# EAGLE board PDC Senior Project (EAGLE 7.7.0), part 1 of 2
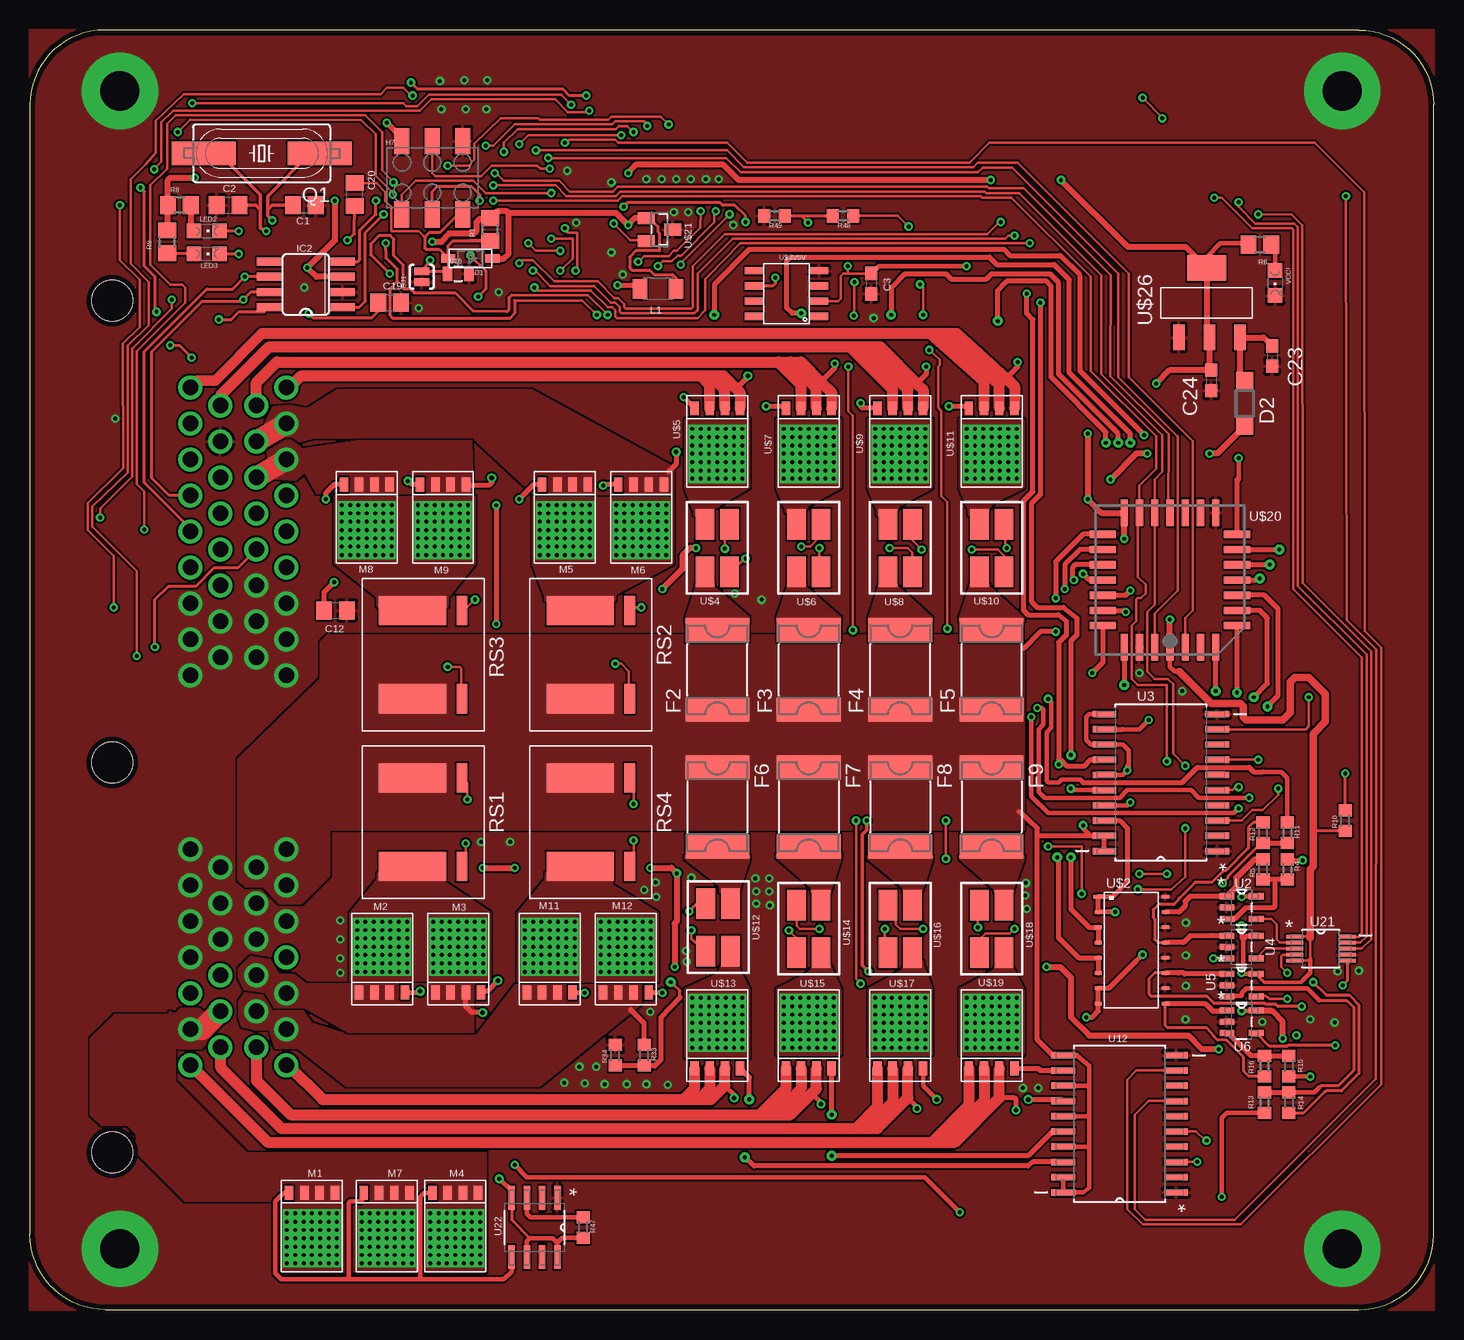
[diagram p7: board, top side]
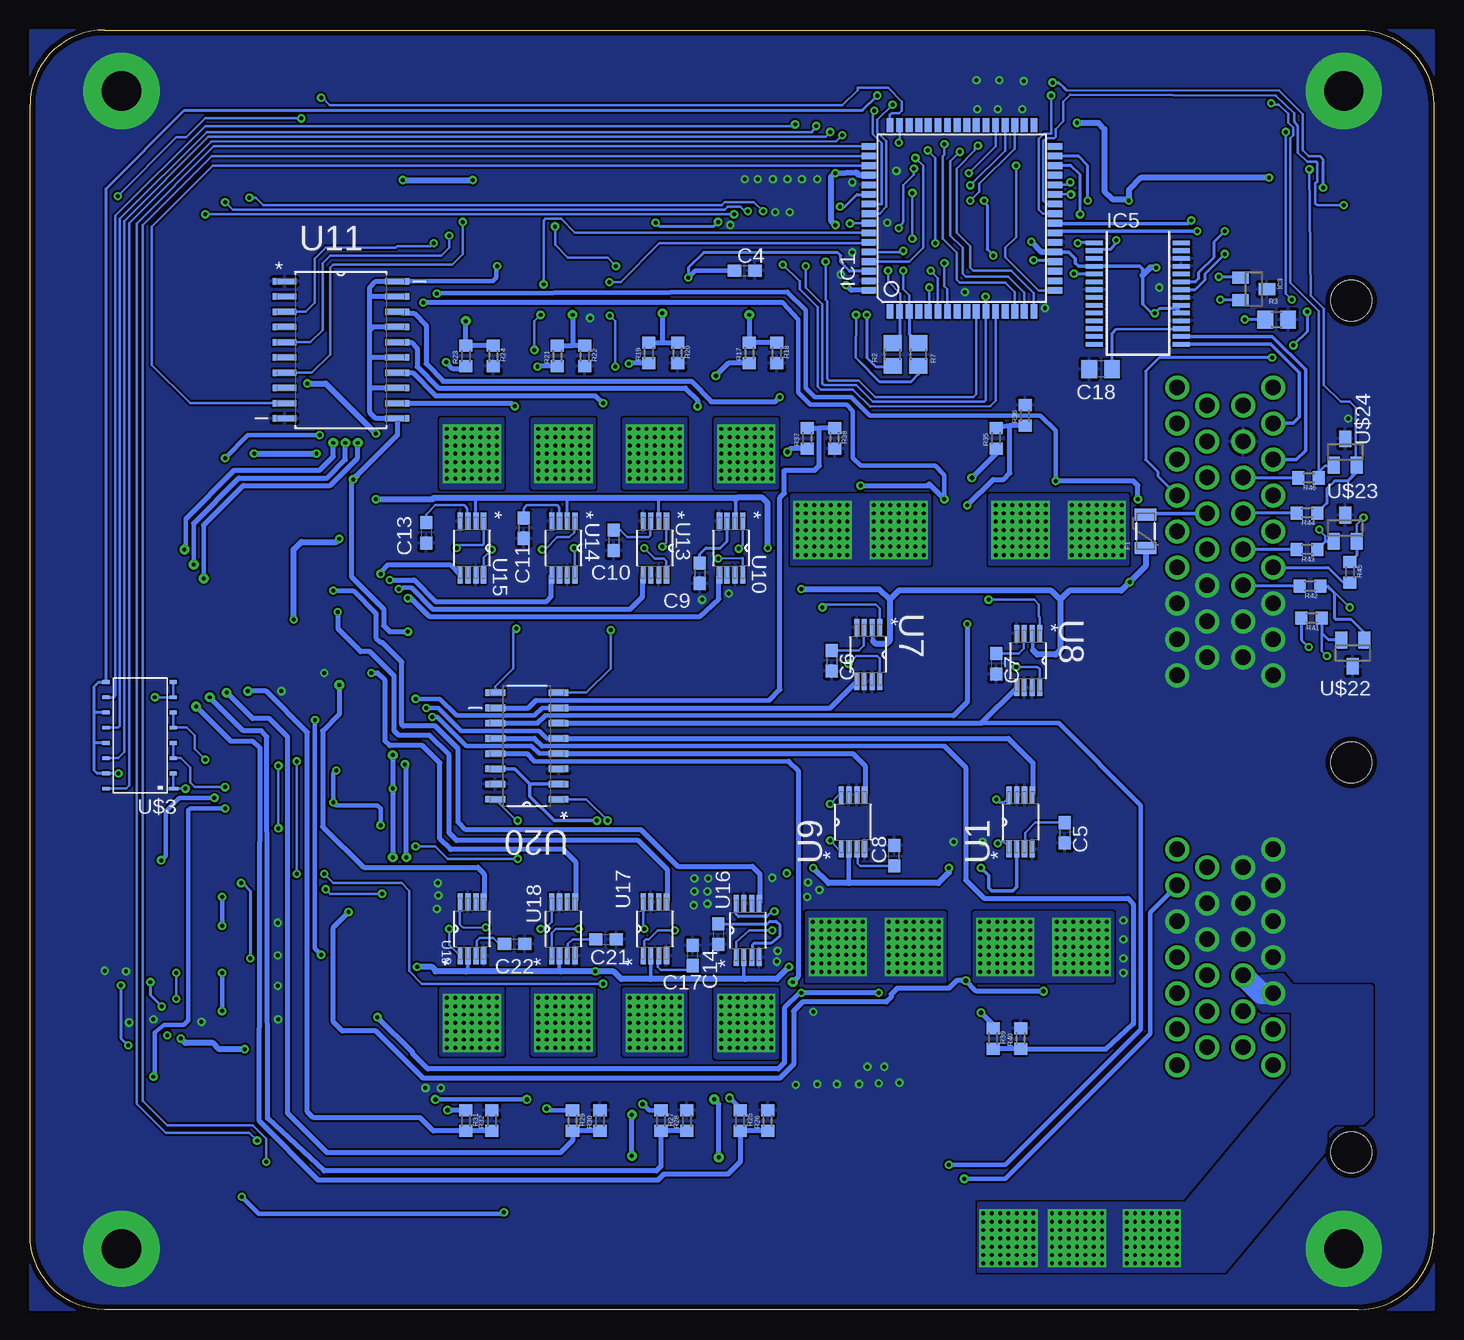
[diagram p8: board, bottom side, seen from below]

Size 116.97 x 106.68 mm. Coordinates in mm from the lower left corner, seen from the top.
Outline: 6.29,0 110.74,0 arc90 116.97,6.22 116.97,100.46 arc90 110.74,106.68 6.22,106.68 arc90 0,100.46 0,6.29 arc90 6.29,0
Copper layers (1*16): Top 0.0356mm / dielectric 1.5011mm / Bottom 0.0356mm
Design rules "OshPark DRC *": minimum track width 6mil, minimum drill 13mil, track to track 6.5mil, track to pad 6.5mil, pad to pad 6.5mil, via to via 6.5mil, smd to smd 6.5mil, copper to edge 17mil, drill to drill 7mil, minimum pad ring 7mil, minimum via ring 7mil, stop-mask expansion 3mil, vias tented up to drill 0mil, thermal gap 10mil

## Footprints (pad centres in the part's own frame; a part is rotated, then mirrored left to right if it is on the bottom)
C0805 = smd 1.3 x 1.5: 1 -0.95,0; 2 0.95,0
C0603 = smd 1.1 x 1: 1 -0.85,0; 2 0.85,0
0805 = smd 0.8 x 1.2: 1 -0.9,0; 2 0.9,0
SOD-123 = smd 1.2 x 0.7: A 1.85,0; C -1.85,0
SOD123 = smd 1.4 x 1.4: A 1.9,0; C -1.9,0
PTC-1206 = smd 1 x 1.8: 1 -1.4,0; 2 1.4,0
2920L = smd 2 x 5.3: 1 -3.3,0; 2 3.3,0
#4-40-PAD-ROUND = drill 3.264 pad 6.35: P$1 0,0
2X3_SMD_FCI_54202-G30 = smd 1.27 x 2.18: 1 -2.54,-3.05; 2 -2.54,3.05; 3 0,-3.05; 4 0,3.05; 5 2.54,-3.05; 6 2.54,3.05
TQFP64 = smd 1.194 x 0.559: 1 -7.76,6; 2 -7.76,5.2; 3 -7.76,4.4; 4 -7.76,3.6; 5 -7.76,2.8; 6 -7.76,2; 7 -7.76,1.2; 8 -7.76,0.4; 9 -7.76,-0.4; 10 -7.76,-1.2; 11 -7.76,-2; 12 -7.76,-2.8; 13 -7.76,-3.6; 14 -7.76,-4.4; 15 -7.76,-5.2; 16 -7.76,-6; 33 7.76,-6; 34 7.76,-5.2; 35 7.76,-4.4; 36 7.76,-3.6; 37 7.76,-2.8; 38 7.76,-2; 39 7.76,-1.2; 40 7.76,-0.4; 41 7.76,0.4; 42 7.76,1.2; 43 7.76,2; 44 7.76,2.8; 45 7.76,3.6; 46 7.76,4.4; 47 7.76,5.2; 48 7.76,6 | smd 0.559 x 1.194: 17 -6,-7.76; 18 -5.2,-7.76; 19 -4.4,-7.76; 20 -3.6,-7.76; 21 -2.8,-7.76; 22 -2,-7.76; 23 -1.2,-7.76; 24 -0.4,-7.76; 25 0.4,-7.76; 26 1.2,-7.76; 27 2,-7.76; 28 2.8,-7.76; 29 3.6,-7.76; 30 4.4,-7.76; 31 5.2,-7.76; 32 6,-7.76; 49 6,7.76; 50 5.2,7.76; 51 4.4,7.76; 52 3.6,7.76; 53 2.8,7.76; 54 2,7.76; 55 1.2,7.76; 56 0.4,7.76; 57 -0.4,7.76; 58 -1.2,7.76; 59 -2,7.76; 60 -2.8,7.76; 61 -3.6,7.76; 62 -4.4,7.76; 63 -5.2,7.76; 64 -6,7.76
SO08 = smd 0.66 x 2.032: 1 -1.905,-3.073; 2 -0.635,-3.073; 3 0.635,-3.073; 4 1.905,-3.073; 5 1.905,3.073; 6 0.635,3.073; 7 -0.635,3.073; 8 -1.905,3.073
SOT-23 = smd 1 x 1.4: 1 -0.95,-1.1; 2 0.95,-1.1; 3 0,1.1
SSOP28 = smd 0.381 x 1.499: 1 -4.225,-3.625; 2 -3.575,-3.625; 3 -2.925,-3.625; 4 -2.275,-3.625; 5 -1.625,-3.625; 6 -0.975,-3.625; 7 -0.325,-3.625; 8 0.325,-3.625; 9 0.975,-3.625; 10 1.625,-3.625; 11 2.275,-3.625; 12 2.925,-3.625; 13 3.575,-3.625; 14 4.225,-3.625; 15 4.225,3.625; 16 3.575,3.625; 17 2.925,3.625; 18 2.275,3.625; 19 1.625,3.625; 20 0.975,3.625; 21 0.325,3.625; 22 -0.325,3.625; 23 -0.975,3.625; 24 -1.625,3.625; 25 -2.275,3.625; 26 -2.925,3.625; 27 -3.575,3.625; 28 -4.225,3.625
L3216C = smd 1.2 x 1.6: 1 -1.5,0; 2 1.5,0
CHIPLED_0805 = smd 1.2 x 1.2: A 0,-1.05; C 0,1.05
SOT669(LFPAK_POWER-SO8) = smd 0.7 x 1.15: 1 -1.905,-2.75; 2 -0.635,-2.75; 3 0.635,-2.75; 4 1.905,-2.75 | drill 0.33 pad 0.508 square: P$1 -2.083,3.124; P$2 -1.388,3.124; P$3 -2.083,-1.041; P$4 -0.694,3.124; P$5 -1.388,-1.041; P$6 0,3.124; P$7 -0.694,-1.041; P$8 0.694,3.124; P$9 1.388,3.124; P$10 0,-1.041; P$11 0.694,-1.041; P$12 1.388,-1.041; P$13 2.083,-1.041; P$18 2.083,3.124; P$19 -2.083,2.43; P$20 -1.388,2.43; P$21 -0.694,2.43; P$22 0,2.43; P$23 0.694,2.43; P$24 1.388,2.43; P$25 2.083,2.43; P$28 -2.083,1.736; P$29 -1.388,1.736; P$30 -0.694,1.736; P$31 0,1.736; P$32 0.694,1.736; P$33 1.388,1.736; P$34 2.083,1.736; P$37 -2.083,1.041; P$38 -1.388,1.041; P$39 -0.694,1.041; P$40 0,1.041; P$41 0.694,1.041; P$42 1.388,1.041; P$43 2.083,1.041; P$46 -2.083,0.347; P$47 -1.388,0.347; P$48 -0.694,0.347; P$49 0,0.347; P$50 0.694,0.347; P$51 1.388,0.347; P$52 2.083,0.347; P$55 -2.083,-0.347; P$56 -1.388,-0.347; P$57 -0.694,-0.347; P$58 0,-0.347; P$59 0.694,-0.347; P$60 1.388,-0.347; P$61 2.083,-0.347
HC49UP = smd 5.334 x 1.93: 1 -4.826,0; 2 4.826,0
R0805 = smd 1.3 x 1.5: 1 -0.95,0; 2 0.95,0
R0603 = smd 1 x 1.1: 1 -0.85,0; 2 0.85,0
WSL2726_RES = smd 2.438 x 5.588: PAS1 -3.683,0; PAS2 3.683,0 | smd 2.438 x 0.889: SENSE1 -3.683,4.128; SENSE2 3.683,4.128
SJ_2S-NO = smd 0.635 x 1.27: 1 -0.45,0; 2 0.45,0
SOP65P490X110-8N = smd 1.397 x 0.432: 1 -2.261,0.965; 2 -2.261,0.33; 3 -2.261,-0.33; 4 -2.261,-0.965; 5 2.261,-0.965; 6 2.261,-0.33; 7 2.261,0.33; 8 2.261,0.965
SOT95P280X100-5N = smd 1.219 x 0.508: 1 -1.219,0.94; 2 -1.219,0; 3 -1.219,-0.94; 4 1.219,-0.94; 5 1.219,0.94
SOIC127P1032X264-20N = smd 1.981 x 0.533: 1 -4.699,5.715; 2 -4.699,4.445; 3 -4.699,3.175; 4 -4.699,1.905; 5 -4.699,0.635; 6 -4.699,-0.635; 7 -4.699,-1.905; 8 -4.699,-3.175; 9 -4.699,-4.445; 10 -4.699,-5.715; 11 4.699,-5.715; 12 4.699,-4.445; 13 4.699,-3.175; 14 4.699,-1.905; 15 4.699,-0.635; 16 4.699,0.635; 17 4.699,1.905; 18 4.699,3.175; 19 4.699,4.445; 20 4.699,5.715
SOIC127P600X175-16N = smd 1.651 x 0.559: 1 -2.642,4.445; 2 -2.642,3.175; 3 -2.642,1.905; 4 -2.642,0.635; 5 -2.642,-0.635; 6 -2.642,-1.905; 7 -2.642,-3.175; 8 -2.642,-4.445; 9 2.642,-4.445; 10 2.642,-3.175; 11 2.642,-1.905; 12 2.642,-0.635; 13 2.642,0.635; 14 2.642,1.905; 15 2.642,3.175; 16 2.642,4.445
SOP50P490X110-10N = smd 1.422 x 0.305: 1 -2.184,0.991; 2 -2.184,0.508; 3 -2.184,0; 4 -2.184,-0.508; 5 -2.184,-0.991; 6 2.184,-0.991; 7 2.184,-0.508; 8 2.184,0; 9 2.184,0.508; 10 2.184,0.991
SOIC127P600X175-8N = smd 1.981 x 0.533: 1 -2.464,1.905; 2 -2.464,0.635; 3 -2.464,-0.635; 4 -2.464,-1.905; 5 2.464,-1.905; 6 2.464,-0.635; 7 2.464,0.635; 8 2.464,1.905
SOIC16NB = smd 0.305 x 0.8: 1 -4.445,-2.8 | smd 0.305 x 0.61: 2 -3.175,-2.8; 3 -1.905,-2.8; 4 -0.635,-2.8; 5 0.635,-2.8; 6 1.905,-2.8; 7 3.175,-2.8; 8 4.445,-2.8; 9 4.445,2.8; 10 3.175,2.8; 11 1.905,2.8; 12 0.635,2.8; 13 -0.635,2.8; 14 -1.905,2.8; 15 -3.175,2.8; 16 -4.445,2.8
LVK2010 = smd 2.55 x 1.55: I1 -1.975,-1.025; I2 1.975,-1.025; V1 -1.975,1.025; V2 1.975,1.025
8-SOIC = smd 0.6 x 1.55: P1 -1.905,-2.7; P2 -0.635,-2.7; P3 0.635,-2.7; P4 1.905,-2.7; P5 1.905,2.7; P6 0.635,2.7; P7 -0.635,2.7; P8 -1.905,2.7
PLCC28S = smd 0.6 x 2.2: 1 0,5.6; 2 -1.27,5.6; 3 -2.54,5.6; 4 -3.81,5.6; 12 -3.81,-5.6; 13 -2.54,-5.6; 14 -1.27,-5.6; 15 0,-5.6; 16 1.27,-5.6; 17 2.54,-5.6; 18 3.81,-5.6; 26 3.81,5.6; 27 2.54,5.6; 28 1.27,5.6 | smd 2.2 x 0.6: 5 -5.6,3.81; 6 -5.6,2.54; 7 -5.6,1.27; 8 -5.6,0; 9 -5.6,-1.27; 10 -5.6,-2.54; 11 -5.6,-3.81; 19 5.6,-3.81; 20 5.6,-2.54; 21 5.6,-1.27; 22 5.6,0; 23 5.6,1.27; 24 5.6,2.54; 25 5.6,3.81
SOT23 = smd 1 x 1.4: 1 -0.95,-1.1; 2 0.95,-1.1; 3 0,1.1
SOT23-3 = smd 1 x 1.4: 1 -0.95,-1.1; 2 0.95,-1.1; 3 0,1.1
SUPERSEAL1.0_60POS = drill 1.3 pad 2: A1 -21,6; A2 -18,6; A3 -15,6; A4 -12,6; A5 -9,6; A6 -6,6; A7 -3,6; A8 0,6; A9 3,6; A10 -19.5,3.5; A11 -16.5,3.5; A12 -13.5,3.5; A13 -10.5,3.5; A14 -7.5,3.5; A15 -4.5,3.5; A16 -1.5,3.5; A17 1.5,3.5; A18 -19.5,0.5; A19 -16.5,0.5; A20 -13.5,0.5; A21 -10.5,0.5; A22 -7.5,0.5; A23 -4.5,0.5; A24 -1.5,0.5; A25 1.5,0.5; A26 -21,-2; A27 -18,-2; A28 -15,-2; A29 -12,-2; A30 -9,-2; A31 -6,-2; A32 -3,-2; A33 0,-2; A34 3,-2; B1 17.5,6; B2 20.5,6; B3 23.5,6; B4 26.5,6; B5 29.5,6; B6 32.5,6; B7 35.5,6; B8 19,3.5; B9 22,3.5; B10 25,3.5; B11 28,3.5; B12 31,3.5; B13 34,3.5; B14 19,0.5; B15 22,0.5; B16 25,0.5; B17 28,0.5; B18 31,0.5; B19 34,0.5; B20 17.5,-2; B21 20.5,-2; B22 23.5,-2; B23 26.5,-2; B24 29.5,-2; B25 32.5,-2; B26 35.5,-2 | hole 3.4: -28.25,-8.5; 10.25,-8.5; 42.75,-8.5
SOT-223-4 = smd 0.95 x 2.15: 1 -2.3,-2.9; 2 0.24,-2.9; 3 2.78,-2.9 | smd 3.25 x 2.15: 4 0,2.9

## Placement (x,y rotation side)
C1  18pF  [C0805]  22.86,92.08 180 top
C2  18pF  [C0805]  16.51,92.08 0 top
C3  2.2uF  [C0603]  70.1,85.53 270 top
C4  2.2uF  [C0603]  57.4,86.61 0 bottom
C5  220p  [C0603]  30.73,39.75 270 bottom
C6  220p  [C0603]  50.16,54.1 270 bottom
C7  220p  [C0603]  36.45,53.85 270 bottom
C8  220p  [C0603]  44.96,37.85 90 bottom
C9  220p  [C0603]  61.15,61.4 270 bottom
C10  220p  [C0603]  68.33,64.14 270 bottom
C11  220p  [C0603]  75.82,65.15 270 bottom
C12  100n  [C0805]  25.46,58.29 0 top
C13  220p  [C0603]  83.95,64.77 270 bottom
C14  220p  [C0603]  59.63,31.31 270 bottom
C16  4.7nF  [0805]  35.69,86.36 0 top
C17  220p  [C0603]  61.72,29.53 90 bottom
C18  100n  [C0805]  27.75,78.42 180 bottom
C19  100n  [C0805]  29.97,83.95 0 top
C20  100n  [C0805]  27.05,92.96 90 top
C21  220p  [C0603]  68.96,30.86 0 bottom
C22  220p  [C0603]  76.58,30.48 0 bottom
C23  10uF  [C0603]  103.5,79.5 270 top
C24  10uF  [C0603]  98.42,77.47 270 top
D1  1N4148  [SOD-123]  36.7,87.63 180 top
D2  1N5819  [SOD123]  101.22,75.56 270 top
F1  16V,0.25A  [PTC-1206]  24,64.9 90 bottom
F2  PTC_FUSE2002920L  [2920L]  57.28,53.34 90 top
F3  PTC_FUSE2002920L  [2920L]  64.9,53.34 90 top
F4  PTC_FUSE2002920L  [2920L]  72.52,53.34 90 top
F5  PTC_FUSE2002920L  [2920L]  80.14,53.34 90 top
F6  PTC_FUSE2002920L  [2920L]  57.28,41.91 270 top
F7  PTC_FUSE2002920L  [2920L]  64.9,41.91 270 top
F8  PTC_FUSE2002920L  [2920L]  72.52,41.91 270 top
F9  PTC_FUSE2002920L  [2920L]  80.14,41.91 270 top
H1  MOUNT-PAD-ROUND#4-40-PAD  [#4-40-PAD-ROUND]  109.35,101.6 0 top
H2  MOUNT-PAD-ROUND#4-40-PAD  [#4-40-PAD-ROUND]  109.35,5.08 0 top
H3  MOUNT-PAD-ROUND#4-40-PAD  [#4-40-PAD-ROUND]  7.49,5.08 0 top
H4  MOUNT-PAD-ROUND#4-40-PAD  [#4-40-PAD-ROUND]  7.49,101.6 0 top
H7  ICSP  [2X3_SMD_FCI_54202-G30]  33.53,94.36 0 top
IC1  AT90CAN128  [TQFP64]  39.3,90.98 90 bottom
IC2  MCP2551SO8  [SO08]  22.99,85.47 90 top
IC3  NUP2105L  [SOT-23]  14.99,85.09 270 bottom
IC5  FT232RL  [SSOP28]  24.64,84.71 270 bottom
L1  CS321613-100K  [L3216C]  52.32,85.09 180 top
LED2  RX  [CHIPLED_0805]  14.73,89.92 270 top
LED3  TX  [CHIPLED_0805]  14.73,88.01 270 top
M1  PSMN2R2-25YLC  [SOT669(LFPAK_POWER-SO8)]  23.5,6.99 180 top
M2  PSMN2R2-25YLC  [SOT669(LFPAK_POWER-SO8)]  29.34,29.21 0 top
M3  PSMN2R2-25YLC  [SOT669(LFPAK_POWER-SO8)]  35.69,29.21 0 top
M4  PSMN2R2-25YLC  [SOT669(LFPAK_POWER-SO8)]  35.43,6.99 180 top
M5  PSMN2R2-25YLC  [SOT669(LFPAK_POWER-SO8)]  44.58,66.04 180 top
M6  PSMN2R2-25YLC  [SOT669(LFPAK_POWER-SO8)]  50.93,66.04 180 top
M7  PSMN2R2-25YLC  [SOT669(LFPAK_POWER-SO8)]  29.72,6.99 180 top
M8  PSMN2R2-25YLC  [SOT669(LFPAK_POWER-SO8)]  28.07,66.04 180 top
M9  PSMN2R2-25YLC  [SOT669(LFPAK_POWER-SO8)]  34.42,66.04 180 top
M11  PSMN2R2-25YLC  [SOT669(LFPAK_POWER-SO8)]  43.31,29.21 0 top
M12  PSMN2R2-25YLC  [SOT669(LFPAK_POWER-SO8)]  49.66,29.21 0 top
Q1  56P2859  [HC49UP]  19.3,96.39 180 top
R1  100K  [R0805]  38.35,90.04 90 top
R2  1k  [R0805]  45.09,79.63 90 bottom
R3  100K  [R0805]  13.08,82.55 0 bottom
R4  3k  [R0603]  104.77,36.7 270 top
R5  10k  [R0603]  102.74,36.7 90 top
R6  1K  [R0805]  102.49,88.77 180 top
R7  1k  [R0805]  42.93,79.63 90 bottom
R8  1k  [R0805]  12.45,92.08 180 top
R9  1k  [R0805]  11.43,89.03 90 top
R10  10k  [R0603]  109.6,40.77 90 top
R11  3k  [R0603]  104.77,39.75 270 top
R12  10k  [R0603]  102.74,39.75 90 top
R13  3k  [R0603]  102.87,17.27 90 top
R14  10k  [R0603]  104.9,17.27 270 top
R15  3k  [R0603]  104.9,20.32 90 top
R16  10k  [R0603]  102.87,20.32 270 top
R17  26k  [R0603]  57.02,79.76 90 bottom
R18  10k  [R0603]  54.74,79.76 270 bottom
R19  26k  [R0603]  65.41,79.76 90 bottom
R20  10k  [R0603]  62.99,79.76 270 bottom
R21  26k  [R0603]  73.02,79.5 90 bottom
R22  10k  [R0603]  70.74,79.5 270 bottom
R23  26k  [R0603]  80.64,79.5 90 bottom
R24  10k  [R0603]  78.36,79.5 270 bottom
R25  26k  [R0603]  57.78,15.75 270 bottom
R26  10k  [R0603]  55.5,15.75 90 bottom
R27  26k  [R0603]  64.39,15.75 270 bottom
R28  10k  [R0603]  62.23,15.75 90 bottom
R29  26k  [R0603]  71.75,15.75 270 bottom
R30  10k  [R0603]  69.47,15.75 90 bottom
R31  26k  [R0603]  80.64,15.75 270 bottom
R32  10k  [R0603]  78.49,15.75 90 bottom
R33  26k  [R0603]  51.18,21.21 270 top
R34  10k  [R0603]  48.77,21.21 90 top
R35  26k  [R0603]  36.45,72.64 90 bottom
R36  10k  [R0603]  34.04,74.55 90 bottom
R37  26k  [R0603]  52.2,72.64 90 bottom
R38  10k  [R0603]  49.91,72.64 270 bottom
R39  26k  [R0603]  36.7,22.61 270 bottom
R40  10k  [R0603]  34.42,22.61 90 bottom
R41  2k1  [R0603]  10.16,57.66 180 bottom
R42  2k1  [R0603]  10.29,60.33 180 bottom
R43  2k1  [R0603]  10.54,63.37 180 bottom
R44  2k1  [R0603]  10.54,66.42 180 bottom
R45  2k1  [R0603]  6.98,61.47 270 bottom
R46  2k1  [R0603]  10.41,69.34 180 bottom
R47  14k7  [R0603]  46.1,6.86 270 top
R48  26k  [R0603]  67.75,91.19 180 top
R49  10k  [R0603]  62.04,91.19 180 top
RS1  0.002  [WSL2726_RES]  31.88,40.64 270 top
RS2  0.002  [WSL2726_RES]  45.85,54.61 270 top
RS3  0.002  [WSL2726_RES]  31.88,54.61 270 top
RS4  0.002  [WSL2726_RES]  45.85,40.64 270 top
SJ1  SOLDERJUMPERNO  [SJ_2S-NO]  32.64,86.11 90 top
U1  LT6100HMS8PBF  [SOP65P490X110-8N]  34.42,40.64 90 bottom
U2  LT1716IS5PBF  [SOT95P280X100-5N]  100.97,33.53 0 top
U3  LT1161ISWPBF  [SOIC127P1032X264-20N]  94.23,43.94 180 top
U4  LT1716IS5PBF  [SOT95P280X100-5N]  100.97,30.23 0 top
U5  LT1716IS5PBF  [SOT95P280X100-5N]  100.97,27.05 0 top
U6  LT1716IS5PBF  [SOT95P280X100-5N]  100.97,24 0 top
U7  LT6100HMS8PBF  [SOP65P490X110-8N]  47.12,54.61 270 bottom
U8  LT6100HMS8PBF  [SOP65P490X110-8N]  33.78,54.1 270 bottom
U9  LT6100HMS8PBF  [SOP65P490X110-8N]  48.39,40.64 90 bottom
U10  LT6100HMS8PBF  [SOP65P490X110-8N]  58.55,63.5 270 bottom
U11  LT1161ISWPBF  [SOIC127P1032X264-20N]  91.06,80.01 0 bottom
U12  LT1161ISWPBF  [SOIC127P1032X264-20N]  90.8,15.49 180 top
U13  LT6100HMS8PBF  [SOP65P490X110-8N]  64.9,63.5 270 bottom
U14  LT6100HMS8PBF  [SOP65P490X110-8N]  72.52,63.5 270 bottom
U15  LT6100HMS8PBF  [SOP65P490X110-8N]  80.14,63.5 270 bottom
U16  LT6100HMS8PBF  [SOP65P490X110-8N]  57.15,31.62 90 bottom
U17  LT6100HMS8PBF  [SOP65P490X110-8N]  64.9,31.75 90 bottom
U18  LT6100HMS8PBF  [SOP65P490X110-8N]  72.52,31.75 90 bottom
U19  LT6100HMS8PBF  [SOP65P490X110-8N]  80.14,31.75 90 bottom
U20  DG409DY-E3  [SOIC127P600X175-16N]  75.56,46.99 180 bottom
U21  AD5314WARMZ-REEL7  [SOP50P490X110-10N]  107.57,30.1 0 top
U22  LT1910IS8TRPBF  [SOIC127P600X175-8N]  42.04,6.86 270 top
U$2  MMPQ3904  [SOIC16NB]  91.82,29.97 270 top
U$3  MMPQ3906  [SOIC16NB]  107.82,47.88 90 bottom
U$4  0.02  [LVK2010]  57.28,63.5 90 top
U$4V5V  MAX6350CSA  [8-SOIC]  63.06,84.71 90 top
U$5  PSMN2R2-25YLC  [SOT669(LFPAK_POWER-SO8)]  57.28,72.39 180 top
U$6  0.02  [LVK2010]  64.9,63.5 90 top
U$7  PSMN2R2-25YLC  [SOT669(LFPAK_POWER-SO8)]  64.9,72.39 180 top
U$8  0.02  [LVK2010]  72.52,63.5 90 top
U$9  PSMN2R2-25YLC  [SOT669(LFPAK_POWER-SO8)]  72.52,72.39 180 top
U$10  0.02  [LVK2010]  80.14,63.5 90 top
U$11  PSMN2R2-25YLC  [SOT669(LFPAK_POWER-SO8)]  80.14,72.39 180 top
U$12  0.02  [LVK2010]  57.34,31.88 270 top
U$13  PSMN2R2-25YLC  [SOT669(LFPAK_POWER-SO8)]  57.28,22.86 0 top
U$14  0.02  [LVK2010]  64.9,31.75 270 top
U$15  PSMN2R2-25YLC  [SOT669(LFPAK_POWER-SO8)]  64.9,22.86 0 top
U$16  0.02  [LVK2010]  72.52,31.75 270 top
U$17  PSMN2R2-25YLC  [SOT669(LFPAK_POWER-SO8)]  72.52,22.86 0 top
U$18  0.02  [LVK2010]  80.14,31.75 270 top
U$19  PSMN2R2-25YLC  [SOT669(LFPAK_POWER-SO8)]  80.14,22.86 0 top
U$20  DG407  [PLCC28S]  95,60.83 180 top
U$21  MCP970X  [SOT23]  52.45,90.04 270 top
U$22  AZ23C4V7-7-F  [SOT23-3]  6.73,54.74 180 bottom
U$23  AZ23C4V7-7-F  [SOT23-3]  7.37,65.15 0 bottom
U$24  AZ23C4V7-7-F  [SOT23-3]  7.37,71.5 0 bottom
U$25  SUPERSEAL1.0_60POS  [SUPERSEAL1.0_60POS]  15.37,55.88 270 top
U$26  NCP1117  [SOT-223-4]  98.04,83.95 0 top
VCC!  PWR  [CHIPLED_0805]  103.76,85.6 180 top

## Tracks (layer width: path | path; a pad name or v marks a point on that pad's centre or on a via)
5V_REG_IN
  Top 0.508: D2.C 100.82,77.86 U$26.3 102.81,81.05 C23.1
5VREF  (via drill 0.33 pad 0.69)
  Top 0.254: v62.1,86.04 62.1,85.53 61.91,85.34 U$4V5V.P6
  Bottom 0.254: IC1.62 48.67,86.58 49.4,87.31 49.4,87.88 49.66,88.14 60.83,88.14 62.1,86.87 v62.1,86.04
  Bottom 0.381: C4.1 61.53,86.61 v62.1,86.04
12V  (via drill 0.33 pad 0.41, 0.33 pad 0.69, 0.33 pad 0.74)
  Top 0.203: U$4V5V.P2 67.37,84.07 67.56,84.26 67.56,86.17 67.75,86.36 68.13,86.36 | 68.13,86.36 70.06,86.36 C3.1 | R48.1 72.33,91.19 v73.22,90.3 | v68.13,87 68.13,86.36
  Top 0.254: U22.4 40.13,7.49 41.66,5.97
  Top 0.381: 88.27,13.59 88.27,10.16 87.76,9.78 U12.20 U12.19 | 88.27,13.59 88.27,16.13 | 88.27,16.13 88.27,18.67 | 88.27,18.67 88.27,20.32 87.25,21.21 | U12.17 88.27,13.59 | U12.15 88.27,16.13 | U12.13 88.27,18.67 | U22.6 41.4,5.71 41.66,5.97 43.56,5.97 43.94,5.59 | 43.94,5.59 U22.8 | R47.2 44.36,6.01 43.94,5.59 | U22.4 40.13,9.91 v39.12,10.92 | U3.11 88.27,49.66 88.01,49.4 88.01,47.5 88.39,47.12 U3.13 91.06,47.12 91.57,46.61 91.57,45.47 | 91.57,45.47 91.57,45.09 v91.44,44.96 | v91.44,44.96 91.06,44.58 U3.15 | v91.44,44.96 91.44,45.34 91.57,45.47 | U3.17 91.44,42.04 v91.69,42.29 | U3.19 88.39,39.5 87.76,40.13 v87.76,40.39 | v78.04,87 70.72,87 C3.1
  Top 0.406: v85.47,56.52 84.2,56.52 82.8,55.12 | 87.25,21.21 U12.11 85.22,21.21 83.95,22.48 83.95,39.5 | U3.20 U3.19 83.95,39.5 | 82.42,41.53 83.95,40.13 83.95,39.5
  Top 0.508: D2.A 98.93,71.37 v98.3,71.37 | v93.09,71.37 92.2,71.37 v90.04,69.22
  Bottom 0.203: v73.22,90.3 73.22,88.77 72.14,87.69 68.83,87.69 v68.13,87
  Bottom 0.381: v39.12,10.92 35.69,10.92 23.62,22.99 23.62,33.12 U$25.B2 | 91.57,44.83 v91.44,44.96 91.69,44.7 v91.69,42.29 91.44,42.04 88.01,42.04 87.76,41.78 v87.76,40.39 | U11.20 78.42,85.72 78.11,86.04 78.11,86.93 v78.04,87
  Bottom 0.406: 88.65,76.71 88.65,74.8 88.14,74.3 U11.11 86.36,72.9 89.72,69.53 | 88.65,76.71 88.65,79.5 | 88.65,79.5 88.65,81.66 | 88.65,81.66 88.65,84.45 | 88.65,84.45 88.65,85.22 88.14,85.72 U11.20 | U11.19 88.65,84.45 | U11.17 88.39,81.92 88.65,81.66 | U11.15 88.52,79.38 88.65,79.5 | U11.13 88.52,76.83 88.65,76.71 | v90.04,69.22 90.17,69.09 90.17,61.09 87.5,58.42 87.5,57.02 87,56.52 v85.47,56.52
  Bottom 0.508: v98.3,71.37 v93.09,71.37 | v90.04,69.22 89.72,69.53
  pour Top (no thermals): 24.89,56.26 82.8,56.26 82.8,40.01 24.89,40.01
  pour Top (no thermals): 17.4,35.81 17.4,45.85 24.26,52.58 24.26,55.63 24.89,56.26 24.89,36.2 22.61,33.91 20.83,33.91 19.43,35.31 18.03,35.31
ADC0  (via drill 0.33 pad 0.69)
  Top 0.203: U$20.28 93.73,58.04 95.63,59.94 95.63,72.77 90.68,77.72 90.68,86.36 81.85,95.19 79.38,95.19 78.99,94.81 59.25,94.81 58.04,96.01 v43.18,96.01
  Bottom 0.203: IC1.61 43.69,87.38 42.54,88.52 42.54,95.38 v43.18,96.01
ADC1  (via drill 0.33 pad 0.69)
  Top 0.203: v44.2,88.27 42.16,88.27 v41.53,88.9 | U$20.2 96.27,57.66 96.9,58.29 96.9,72.39 91.57,77.72 91.57,86.36 82.3,95.63 78.99,95.63 78.61,95.25 59.5,95.25 58.1,96.65 v42.16,96.65
  Bottom 0.203: IC1.60 44.28,88.18 v44.2,88.27 | v41.53,88.9 41.53,96.01 v42.16,96.65
ADC2  (via drill 0.33 pad 0.69)
  Top 0.203: v68.58,56.64 68.58,74.55 68.2,74.93 v68.2,78.61 | v68.71,85.66 68.71,82.93 v68.64,82.87
  Bottom 0.203: U20.8 70.61,51.44 68.58,53.47 v68.58,56.64 | v68.2,78.61 68.2,82.42 v68.64,82.87 | IC1.59 47.14,88.9 64.52,88.9 67.75,85.66 v68.71,85.66
ADC3  (via drill 0.33 pad 0.69)
  Top 0.203: v76.45,56.77 76.45,67.31 75.95,67.82 75.95,74.93 75.69,75.18 75.69,78.61 75.82,78.74 75.82,79.18 v74.93,80.01 | v74.42,82.93 74.42,85.22 v74.17,85.47
  Bottom 0.203: U20.9 78.21,51.97 76.71,53.47 76.71,56.52 v76.45,56.77 | v74.93,80.01 74.93,82.42 v74.42,82.93 | v74.17,85.47 74.17,90.81 74.04,90.93 72.71,90.93 71.56,89.79 IC1.58
ANALOG_EMERGENCY_SHUTDOWN  (via drill 0.33, 0.33 pad 0.69)
  Top 0.254: R10.2 v109.6,44.7 | v10.54,83.19 10.41,83.31 10.41,86.11 9.53,87 9.53,93.22 v9.21,93.53 | v11.68,80.39 12.45,80.39 v13.46,79.38 | v46.35,101.22 44.96,101.22 44.45,101.73 32.32,101.73 v31.75,102.3
  Bottom 0.203: 9.21,95.69 9.21,95.89 9.46,96.14 10.41,96.14 10.92,96.65 10.91,99.66 12.87,101.64 30.61,101.66 30.8,101.85
  Bottom 0.254: 111.63,47.24 111.63,44.96 111.38,44.7 U$3.15 v109.6,44.7 | 111.63,47.24 111.63,49.78 | 111.63,49.78 111.63,51.94 111.25,52.32 U$3.9 110.62,93.47 104.1,99.97 47.61,99.99 v46.35,101.22 | U$3.11 111.63,49.78 | U$3.13 111.63,47.24 | v9.21,93.53 9.21,95.69 | v10.54,83.19 10.54,81.53 v11.68,80.39 | v13.46,79.38 22.86,79.38 24,78.23 24,70.87 22.99,69.85 22.99,69.5 U$25.A4 | v31.75,102.3 31.24,102.3 30.8,101.85
AVR_CS  (via drill 0.33 pad 0.69)
  Top 0.203: U21.10 110.72,31.09 111,31.37 111,54.36 105.28,60.07 105.28,90.04 105.16,90.17 101.85,90.17 99.3,92.71 v98.68,92.71 | v55.88,91.57 55.87,90.22 53.9,88.27 53.64,88.27 53.21,87.83 51.19,87.83 v50.67,87.38
  Bottom 0.203: v98.68,92.71 98.17,92.71 97.54,92.08 59.31,92.08 59.05,92.33 56.64,92.33 v55.88,91.57 | v50.67,87.38 50.67,84.19 50.55,84.06 50.55,77.6 50.42,77.47 47.92,77.47 46.52,76.07 38.35,76.07 38.1,76.33 IC1.10
AVR_MOSI  (via drill 0.33 pad 0.69)
  Top 0.203: v54.23,87.12 54.23,87.25 v58.29,91.31 | v102.36,91.31 105.16,91.3 106.03,90.41 106.05,60.58 111.76,54.86 111.76,30.86 111,30.1 U21.8
  Bottom 0.203: v54.23,87.12 52.83,85.72 52.83,85.09 51.31,83.57 51.31,76.96 51.05,76.71 48.41,76.71 46.96,75.3 36.96,75.31 36.5,75.76 IC1.12 | v58.29,91.31 v102.36,91.31
AVR_SCK  (via drill 0.33 pad 0.69)
  Top 0.203: v52.32,87 52.73,87.4 53.49,87.4 53.97,87.88 54.25,87.88 57.02,90.64 57.02,91.44 v57.15,91.57 | v100.71,92.33 100.71,91.95 102.11,90.55 105.35,90.55 105.66,90.23 105.66,60.33 111.38,54.61 111.38,31.11 110.87,30.61 U21.9
  Top 0.254: H7.3 33.53,93.22 33.93,93.65 36.78,93.65 37.46,92.96 v37.46,92.46 | v36.7,87.88 37.97,86.61 37.97,85.09 v37.34,84.45
  Bottom 0.203: IC1.11 37.3,80.3 37.34,80.26 37.34,75.82 37.46,75.69 46.74,75.69 48.13,77.09 50.8,77.09 50.93,77.22 50.93,83.82 52.32,85.22 v52.32,87 | v57.15,91.57 57.4,91.57 57.78,91.95 58.8,91.95 59.05,91.69 100.08,91.69 v100.71,92.33
  Bottom 0.254: v37.46,92.46 37.46,92.33 37.21,92.08 37.21,88.39 v36.7,87.88 | v37.34,84.45 37.34,83.25 IC1.11
BAT_SENSE  (via drill 0.33)
  Top 0.254: v59.63,90.68 59.63,91.19 58.74,92.08 57.72,92.08 57.53,92.27 49.78,92.27 v49.47,91.95 | R48.2 R49.1 64.26,91.19 v64.83,90.61
  Bottom 0.254: v59.63,90.68 59.69,90.74 59.69,90.61 60.01,90.3 64.52,90.3 v64.83,90.61 | v49.47,91.95 49.09,91.95 48.07,92.96 47.08,92.96 IC1.54
CAN_H  (via drill 0.33 pad 0.69)
  Top 0.254: IC2.7 18.41,84.84 v17.78,84.2 17.65,84.07 14.35,84.07 10.16,79.88 10.16,69.34 11.62,67.88 U$25.A29
  Bottom 0.254: v17.78,84.2 16.15,84.2 IC3.2
CAN_L  (via drill 0.33 pad 0.69)
  Top 0.254: IC2.6 v17.91,86.11 16.89,85.09 14.73,85.09 9.53,79.88 9.53,68.96 13.37,65.12 U$25.A30
  Bottom 0.254: v17.91,86.11 16.15,86.11 IC3.1
D+
  Bottom 0.305: IC5.15 13.55,80.48 11.18,78.11 11.18,74.42 11.68,73.91 13.33,73.91 U$25.A27
D-
  Bottom 0.305: IC5.16 13.44,81.13 10.67,78.36 10.67,71.63 11.43,70.87 13.35,70.87 U$25.A28
DTR  (via drill 0.33 pad 0.69)
  Top 0.254: v26.45,89.17 27.04,89.69 C20.1
  Bottom 0.254: v26.45,89.17 26.47,88.99 26.92,88.39 28.16,88.39 IC5.2
GND  (via drill 0.33, 0.33 pad 0.41, 0.33 pad 0.69)
  Bottom 0.254: U1.6 34.09,43.1 34.1,43.12
  other vias: 53.66,91.5 54.86,91.5 51.37,94.23 52.64,94.23 53.85,94.23 55.05,94.23 56.32,94.23 57.4,94.23 48.45,93.98 34.29,100.08 36.32,100.08 38.04,100.08 22.86,85.22 32.38,83.5 39.05,84.84 34.16,102.43 36.2,102.49 38.1,102.49 45.78,20.26 47.18,20.26 44.51,18.92 46.23,18.86 47.88,18.8 49.72,18.8 51.37,18.8 53.15,18.73 60.45,35.94 61.59,35.94 61.59,34.86 60.52,34.86 60.52,33.85 61.66,33.72 102.68,24 106.68,24.19 108.71,23.94 108.97,28.19 110.74,28.26 37.59,38.99 40,38.99 51.69,24.83 82.99,35.56 82.93,34.54 83.06,33.4 82.74,18.48 84.01,18.48 55.12,36 52.13,35.62 51.18,34.99 52.2,34.42 25.84,32.45 25.84,30.86 25.84,29.27 25.84,28.07 7.11,74.3 92.46,53.09 96.01,51.56 58.74,59.69 60.96,59.18 45.53,90.61 44.77,94.93 48.45,88.14 54.67,29.91 54.74,29.02 96.33,29.53 96.29,24.21 96.33,32.26 96.33,26.99 70.29,82.68 49.4,86.3 58.61,90.42
  pour Top (rank 6): 0,106.68 116.97,106.68 116.97,0 0,0
  pour Bottom (rank 6): 0,106.68 116.97,106.68 116.97,0 0,0
  pour Top (no thermals): 3.3,105.73 11.37,105.73 11.37,104.9 11.37,98.23 11.37,98.04 11.37,97.6 3.3,97.6
  pour Bottom (no thermals): 4.32,105.22 10.1,105.22 11.43,103.89 11.43,99.38 9.72,97.66 4.32,97.66 3.17,98.81 3.17,104.08
  pour Top (no thermals): 2.98,8.89 9.97,8.89 11.49,7.37 11.49,2.6 10.48,1.59 10.41,1.59 10.03,1.21 5.02,1.21 2.73,3.49 2.73,8.7 2.79,8.7
  pour Bottom (no thermals): 3.68,9.08 10.35,9.08 12.13,7.3 12.13,2.41 11.37,1.65 11.24,1.65 10.92,1.33 4.64,1.33 3.49,2.48 3.49,8.89
  pour Bottom (no thermals): 107.89,9.97 112.65,9.97 114.55,8.06 114.55,2.1 113.66,1.21 105.66,1.21 104.9,1.97 104.9,6.99
  pour Top (no thermals): 106.17,9.4 111.89,9.4 113.6,7.68 113.6,1.91 112.9,1.21 104.39,1.21 103.44,2.16 103.44,6.67
  pour Top (no thermals): 106.81,105.98 113.28,105.98 114.24,105.03 114.24,98.42 112.71,96.9 108.58,96.9 104.14,101.35 104.14,103.31
  pour Bottom (no thermals): 106.17,106.05 112.33,106.05 113.98,104.39 113.98,99.25 112.46,97.73 107.95,97.73 102.93,102.74 102.93,102.81
  pour Bottom (rank 2, no thermals): 12.45,60.39 13.84,60.39 15.24,58.99 16.95,58.99 17.27,59.31 17.27,60.9 18.22,61.85 19.49,61.85 20.83,60.52 22.29,60.52 22.8,60.01 22.8,52.13 16.83,46.16 16.83,38.04 17.14,37.72 17.14,35.75 17.97,35.24 19.43,35.24 20.38,33.97 20.57,33.97 20.96,33.59 22.29,33.59 22.92,32.96 22.92,31.24 22.48,30.8 20.96,30.8 19.75,29.59 17.02,29.59 16.7,29.27 15.37,29.27 14.41,28.32 14.29,28.32 13.84,27.88 12,27.88 11.43,28.45 11.43,59.37
  pour Top (rank 2, no thermals): 20.83,60.58 22.35,60.58 22.92,60.01 22.92,52.13 16.45,45.66 16.45,38.42 17.08,37.78 17.08,35.81 18.03,34.86 18.03,34.92 18.22,35.12 19.3,35.12 20.83,33.59 22.48,33.59 22.92,33.15 22.92,31.37 22.35,30.8 20.76,30.8 19.62,29.65 16.26,29.65 15.94,29.34 15.49,29.34 13.97,27.81 11.68,27.81 11.3,28.19 11.3,58.99 12.38,60.07 14.54,60.07 15.43,59.18 16.83,59.18 17.21,59.56 17.21,60.96 18.03,61.79 19.37,61.79
HC1_ANALOG_BACKUP_REF
  Top 0.203: U2.4 103.43,32.59 103.89,32.13 103.89,30.86 104.14,30.61 U21.2
HC1_DISCH_TRIGGER
  Top 0.406: U2.1 96.7,34.47 96.27,34.04 96.27,33.66 95.76,33.15 U$2.15
  Top 0.508: U2.1 100.52,35.24 100.52,36.01 102.07,37.55 R5.2
HC1_GATE  (via drill 0.33 pad 0.69, 0.38 pad 0.25)
  Top 0.406: M2.4 32.43,26.46 v32.51,26.54 | v90.42,33.15 U$2.2 U$2.1 90.17,34.42 91.44,35.69 91.44,40.13 90.8,40.77 U3.18 | v38.99,27.43 38.1,26.54 37.67,26.54 M3.4
  Bottom 0.406: v90.42,33.15 91.69,31.88 91.69,24 90.93,23.24 88.14,23.24 84.2,19.3 54.48,19.3 53.34,20.45 53.34,24.89 52.58,25.65 45.59,25.65 45.21,26.04 45.21,26.29 44.7,26.8 40.39,26.8 39.75,27.43 v38.99,27.43 38.1,26.54 v32.51,26.54
HC1_GATE_IN  (via drill 0.33 pad 0.69)
  Top 0.203: v104.01,43.43 104.01,42.93 102.74,41.66 101.85,41.66 100.97,40.77 U3.3
  Bottom 0.203: U$3.2 U$3.1 v104.01,43.43
HC1_ISENSE  (via drill 0.33 pad 0.69)
  Top 0.381: v83.95,50.16 84.33,50.16 84.45,50.04 84.45,48.77 84.07,48.39 84.07,43.18 84.58,42.67 90.8,42.67 91.44,43.31 96.77,43.31 97.41,42.67 v101.6,42.67 | v106.05,37.47 104.86,37.47 R4.1
  Bottom 0.381: U20.5 73.91,47.62 74.55,48.26 81.03,48.26 82.93,50.16 v83.95,50.16 | v101.6,42.67 104.52,42.67 105.66,41.53 105.66,37.85 v106.05,37.47
  Bottom 0.406: U20.5 35.43,47.62 33.4,45.59 33.4,42.95 U1.5
HC1_OUTPUT  (via drill 0.38 pad 0.25)
  Top 0.406: v37.72,24.77 36.83,24.77 36.32,25.27 M3.3
  Bottom 0.406: R39.1 36.7,23.75 v37.72,24.77
  pour Top (no thermals): 22.99,27.18 22.99,25.15 20.45,25.15 19.68,26.42 17.91,26.67 17.4,27.69 17.4,28.45 18.41,29.46 19.94,29.21 20.7,27.94 21.97,27.94
  pour Top (no thermals): 22.48,27.18 36.96,27.18 36.96,23.11 26.54,23.11 22.48,25.4
HC1_VSENSE
  Bottom 0.381: 74.3,46.99 40.77,46.99
  Bottom 0.406: R40.1 34.92,21.76 | 34.92,21.76 R39.2 | U20.12 74.93,47.62 74.3,46.99 | 40.77,46.99 38.99,45.21 38.99,35.81 37.46,34.29 25.46,34.29 25.02,33.78 25.02,23.81 27.3,21.72 34.89,21.72 34.92,21.76
HC2_ANALOG_BACKUP_REF
  Top 0.203: U21.3 103,30.1 U4.4
HC2_DISCH_TRIGGER
  Top 0.254: R12.2 101.94,40.6 101.54,40.2 101.54,38.48 99.63,36.58 99.44,36.58 98.49,35.62 97.09,35.62 95.76,34.29 95.76,34.23 95.31,33.78 94.04,33.78 93.6,33.34 93.6,32.7 93.73,32.58 93.73,30.86 93.98,30.61 U$2.13 94.56,30.67 | 98.49,31.29 98.61,31.17
  Top 0.406: U4.1 98.61,31.17 96.7,31.17 96.14,30.61 U$2.13
HC2_GATE  (via drill 0.33 pad 0.69, 0.33 pad 0.81)
  Top 0.381: U3.16 86.87,43.31 v86.74,43.43
  Top 0.406: M5.4 41.99,68.79 v40.77,67.56 | M6.4 47.84,68.79 v47.75,68.71 | U$2.4 U$2.3 88.27,31.88 86.74,33.4 v86.74,37.72 | v84.2,83.95 84.2,67.94 83.44,67.18 83.44,59.05 83.95,58.55 86.11,58.55 87.25,57.66 87.25,56.26 86.74,55.75 v86.74,46.23
  Bottom 0.381: v40.77,67.56 40.77,69.6 41.53,70.36 47.75,70.36 48.39,70.99 48.39,74.93 48.89,75.44 51.94,75.44 52.96,76.45 52.96,82.55 54.23,83.95
  Bottom 0.406: 42.04,68.83 v40.77,67.56 41.91,68.71 v47.75,68.71 | 54.23,83.95 v84.2,83.95 | v86.74,46.23 v86.74,43.43 v86.74,37.72
HC2_GATE_IN  (via drill 0.33 pad 0.69)
  Top 0.203: v100.71,43.56 100.46,43.56 100.2,43.31 U3.5
  Bottom 0.203: U$3.4 U$3.3 104.39,45.97 103.63,45.21 103.63,43.94 103.25,43.56 v100.71,43.56
HC2_ISENSE  (via drill 0.33 pad 0.69)
  Top 0.381: v84.84,50.93 85.09,50.67 85.09,48.51 84.71,48.13 84.71,44.07 84.84,43.94 85.72,43.94 85.98,44.2 87.5,44.2 87.76,43.94 | R11.1 104.77,44.32 104.27,44.83 102.74,44.83
  Top 0.406: 87.76,43.94 96.01,43.94 97.28,45.21 101.6,45.21 101.98,44.83 102.74,44.83
  Bottom 0.381: U20.7 74.3,50.16 74.93,49.53 81.41,49.53 82.8,50.93 v84.84,50.93
  Bottom 0.406: U20.7 50.27,50.16 U7.5
HC2_OUTPUT  (via drill 0.38 pad 0.25)
  Top 0.406: v53.85,71.5 53.85,70.48 53.21,69.85
  Top 1.778: U$25.A11 U$25.A2
  Bottom 0.406: R37.1 53.55,71.79 v53.85,71.5
  pour Top (rank 3, no thermals): 42.04,67.94 36.96,72.64 23.37,72.64 22.61,73.03 22.61,74.8 25.65,76.71 41.78,76.71 53.59,70.23 53.59,67.94
  pour Top (rank 2, no thermals): 22.86,75.06 21.59,75.31 20.32,75.18 19.68,73.91 20.57,72.39 22.35,72.39 23.37,72.64 22.99,75.06
HC2_VSENSE
  Bottom 0.381: 74.8,50.8 55.37,50.8
  Bottom 0.406: U20.10 75.44,50.16 74.8,50.8 | 55.37,50.8 54.48,51.69 54.48,67.69 54.1,68.07 54.1,69.98 51.56,69.98 51.18,70.36 51.18,73.53 | 51.18,73.53 49.95,73.53 R38.1 | R37.2 51.22,73.49 51.18,73.53
HC3_ANALOG_BACKUP_REF  (via drill 0.33 pad 0.69)
  Top 0.203: U21.4 104.39,29.59 104.27,29.46 104.27,28.57 v104.77,28.07 | v104.77,25.91 103.25,25.91 103,26.16 102.23,26.16 U5.4
  Bottom 0.203: v104.77,28.07 v104.77,25.91
HC3_DISCH_TRIGGER  (via drill 0.33)
  Top 0.254: R14.2 106.15,16.42 107.89,18.16 107.95,18.16 108.01,18.22 109.28,18.22 110.74,19.68 110.74,25.4 109.92,26.23 108.01,26.23 v106.93,27.3 | v105.98,25.27 104.01,25.27 103.82,25.46 103,25.46 102.93,25.53 98.68,25.53 98.11,26.1 93.47,26.1 93.28,26.29 93.28,27.62 93.79,28.13 94.56,28.13 U$2.11 | 95.76,28.13 95.69,28.07
  Top 0.406: U5.1 96.22,27.99 96.14,28.07 95.69,28.07 U$2.11
  Bottom 0.254: v106.93,27.3 106.93,26.23 v105.98,25.27
HC3_GATE  (via drill 0.33 pad 0.69, 0.33 pad 0.81)
  Top 0.406: M8.4 25.36,68.79 24.64,68.07 v24.64,67.56 | M9.4 31.79,68.79 v31.5,69.09 | 85.72,45.85 85.72,55.63 86.36,56.26 86.36,57.4 85.72,57.91 83.19,57.91 82.8,58.29 82.8,67.44 83.57,68.2 83.57,82.55 83.06,83.06 v83.06,84.71 | U$2.6 U$2.5 87.38,29.34 85.72,30.99 85.72,37.59 v85.6,37.72 | v85.72,45.47 85.72,45.85 | 85.72,45.85 85.85,45.85 86.36,45.34 87.88,45.34 88.39,45.85 U3.14
  Bottom 0.368: 32.77,74.55 46.99,74.55
  Bottom 0.381: v31.5,69.09 31.5,73.28 32.77,74.55 | 46.99,74.55 48.51,76.07 51.56,76.07 52.32,76.83 52.32,83.31 53.85,84.84
  Bottom 0.406: v24.64,67.56 24.64,68.71 25.02,69.09 v31.5,69.09 | 53.85,84.84 v83.06,84.71 | v85.6,37.72 85.6,45.21 v85.72,45.47
HC3_GATE_IN  (via drill 0.33 pad 0.69)
  Top 0.203: v102.36,45.85 U3.7
  Bottom 0.203: U$3.6 U$3.5 103.89,48.51 103.25,47.88 103.25,46.74 v102.36,45.85
HC3_ISENSE  (via drill 0.33 pad 0.69)
  Top 0.381: R13.1 99.73,16.42 99.31,16 v99.31,9.4 | v40.39,12.06 41.4,11.05 74.55,11.05 76.96,8.64 v77.47,8.13
  Bottom 0.381: v40.39,12.06 35.69,12.06 24.38,23.37 24.38,42.04 31.24,48.9 37.69,48.9 | v99.31,9.4 97.92,8 77.6,8 v77.47,8.13
  Bottom 0.406: U20.6 37.69,48.9 U8.5
HC3_OUTPUT  (via drill 0.38 pad 0.25)
  Top 0.406: v38.48,69.34 38.48,68.96 38.23,68.71 36.41,68.71 M9.1
  Top 1.778: U$25.A12 U$25.A3
  Bottom 0.406: R35.1 36.45,71.37 v38.48,69.34
  pour Top (rank 2, no thermals): 36.96,68.07 36.83,72.39 27.3,72.39 22.73,71.75 22.73,70.1 23.88,68.07
  pour Top (no thermals): 23.11,70.1 22.1,69.22 20.45,69.34 20.07,70.23 19.81,71.5 20.7,72.39 21.72,72.39 22.48,71.88 22.86,71.37
HC3_VSENSE  (via drill 0.33 pad 0.69)
  Top 0.406: v38.86,67.06 v38.86,57.15
  Bottom 0.381: 74.04,49.53 40,49.53
  Bottom 0.406: R36.1 35.31,73.68 | 35.31,73.68 R35.2 | U20.11 74.68,48.9 74.04,49.53 | 40,49.53 38.86,50.67 v38.86,57.15 | v38.86,67.06 36.7,69.22 35.81,69.22 35.31,69.72 35.31,73.68
HC4_ANALOG_BACKUP_REF  (via drill 0.33)
  Top 0.254: U21.6 109.75,27.39 v109.38,27.03 | v108.77,22.04 104.84,22.04 104.77,21.97 103.28,21.97 U6.4
  Bottom 0.254: v109.38,27.03 109.38,22.63 v108.77,22.04
HC4_DISCH_TRIGGER
  Top 0.254: R16.2 101.56,19.47 101.16,19.88 101.13,21.02 99.68,22.48 98.97,22.47 98.72,22.72 98.68,22.77 98.06,23.5 94.8,23.5 94.61,23.69 U$2.9 | 98.61,24.77 98.74,24.89
  Top 0.406: U$2.9 97.92,25.53 98.55,24.89 98.74,24.89 99.69,24.89 U6.1
HC4_GATE  (via drill 0.33 pad 0.69)
  Top 0.381: 91.06,48.39 92.46,48.39 v93.22,49.15 | v92.71,29.59 92.2,29.08
  Top 0.406: 51.69,26.54 51.61,26.46 M12.4 51.61,26.42 v52.7,26.42 | M11.4 46.18,26.46 v46.23,26.42 | v88.01,24.38 88.52,24.38 89.03,24.89 U$2.8 U$2.7 89.92,26.8 92.2,29.08 | U3.12 91.06,48.39
  Bottom 0.381: v93.22,49.15 93.22,30.1 v92.71,29.59
  Bottom 0.406: v46.23,26.42 v52.7,26.42 52.83,26.42 54.1,25.15 54.1,20.57 54.61,20.07 83.82,20.07 85.09,21.34 85.09,21.46 v88.01,24.38
HC4_GATE_IN  (via drill 0.33 pad 0.69)
  Top 0.203: v106.55,51.05 106.55,48.64 106.3,48.39 U3.9
  Bottom 0.203: U$3.8 U$3.7 v106.55,51.05
HC4_ISENSE  (via drill 0.33 pad 0.69)
  Top 0.381: v83.44,49.4 83.44,42.8 84.84,41.4 100.33,41.4 v100.71,41.78 | v106.68,19.43 104.94,19.43 R15.1
  Bottom 0.381: U20.4 74.55,46.35 75.18,46.99 80.61,46.99 83.02,49.42 v83.44,49.4 | v100.71,41.78 103.63,41.78 103.76,41.66 103.76,24.13 104.14,23.75 105.79,23.75 106.55,23.11 106.55,19.56 v106.68,19.43
  Bottom 0.406: U20.4 48.39,46.35 47.37,45.34 47.37,42.95 U9.5
HC4_OUTPUT
  Top 0.406: R33.1 51.18,23.88 50.04,25.02
  pour Top (rank 2, no thermals): 26.54,22.86 23.5,23.88 21.97,22.1 26.42,18.67 42.42,18.67 50.93,25.53 50.93,27.18 40.51,27.18 37.21,22.86
  pour Top (rank 2, no thermals): 23.5,23.88 22.73,24.89 20.45,24.89 19.68,26.42 17.91,26.42 17.4,25.65 17.4,24.38 17.65,23.62 18.67,23.37 19.94,23.37 20.45,21.84 22.48,21.84 25.78,21.08
HC4_VSENSE  (via drill 0.33 pad 0.81)
  Top 0.254: 54.16,26.04 54.16,26.61 v53.4,27.3
  Top 0.406: 48.73,20.32 R34.1 R33.2 51.22,20.32 52.07,20.32 52.58,20.83 52.58,24.38 54.16,26.04
  Bottom 0.381: 74.93,45.72 53.72,45.72
  Bottom 0.406: U20.13 75.56,46.35 74.93,45.72 | 53.72,45.72 52.96,44.96 52.96,27.75 v53.4,27.3
INPUT1  (via drill 0.33 pad 0.69)
  Top 0.254: v10.41,55.24 10.41,59.18 11.56,60.33 13.84,60.33 15.37,61.85 17.34,61.85 U$25.A14
  Bottom 0.254: R41.2 11.01,55.84 v10.41,55.24
INPUT2
  Bottom 0.254: R42.2 15.81,60.33 U$25.A23
INPUT3
  Bottom 0.254: U$25.A31 8.79,61.88 7.62,60.71 7.07,60.71 R45.2
INPUT4
  Bottom 0.254: R43.2 U$25.A22
INPUT5
  Bottom 0.254: R46.2 15.83,69.34 U$25.A20
INPUT6
  Bottom 0.254: R44.2 15.83,66.42 U$25.A21
INPUT_PIN_1  (via drill 0.33 pad 0.69)
  Top 0.203: v8.89,54.48 8.89,61.59 5.21,65.28 5.21,66.95 8.13,69.79 8.14,80.35 9.89,82.09 9.91,85.66 8.38,87.19 8.38,94.23 9.65,95.5 10.48,96.46 10.48,99.12 12.83,101.35 29.21,101.35 29.72,101.85 31.12,101.85 31.75,101.22 v31.88,101.22
  Bottom 0.203: IC1.25 32.58,91.38 32.89,91.69 32.89,97.62 32.45,98.04 31.88,98.04 v31.88,101.22 | R41.1 9.31,54.9 v8.89,54.48
  Bottom 0.254: R41.1 9.31,56.43 8.76,55.88 7.72,55.88 U$22.2
INPUT_PIN_2  (via drill 0.33 pad 0.69)
  Top 0.203: v6.98,58.55 6.97,62.83 4.81,64.99 4.81,67.25 7.76,70.16 7.75,80.54 9.14,81.92 9.14,85.85 7.49,87.5 v7.49,92.08
  Bottom 0.203: IC1.26 32.23,92.18 32.51,92.46 32.51,97.41 32.26,97.66 31.62,97.66 31.5,97.79 31.5,98.42 30.86,99.06 30.86,100.71 30.29,101.28 13.14,101.22 11.62,99.76 11.62,99.06 11.3,98.68 11.3,96.46 10.54,95.69 9.78,95.69 9.72,95.63 9.72,94.04 9.84,93.92 9.84,92.2 9.72,92.08 v7.49,92.08 | R42.1 8.76,60.33 v6.98,58.55
  Bottom 0.254: U$22.1 5.78,56.45 6.86,57.53 8.13,57.53 8.25,57.66 8.25,59.69 8.89,60.33 R42.1
INPUT_PIN_3  (via drill 0.33 pad 0.69)
  Top 0.203: v30.23,92.96 30.16,93.22 28.83,94.55 28.82,97.98 27.62,99.16 13.33,99.19 v12.32,98.17 | v5.84,66.04 5.84,66.8 8.51,69.47 8.51,80.14 11.81,83.44 v11.81,84.2
  Bottom 0.203: IC1.27 30.24,92.98 v30.23,92.96 | U$23.2 6.42,65.47 v5.84,66.04 | v12.32,98.17 12.32,84.71 v11.81,84.2
  Bottom 0.254: U$23.2 6.42,62.89 R45.1
INPUT_PIN_4  (via drill 0.33 pad 0.69)
  Top 0.203: v30.29,93.98 29.34,95 29.34,98.17 27.94,99.57 12.17,99.57 11.43,98.88 11.43,95.12 10.03,93.73 10.03,87.12 11.68,85.47 12.7,85.47 12.95,85.22 12.95,83.96 8.9,79.92 8.89,68.83 9.53,68.2 v9.53,65.02
  Bottom 0.203: IC1.28 30.56,93.78 v30.29,93.98 | 9.01,64.05 9.01,64.51 v9.53,65.02
  Bottom 0.254: U$23.1 9.01,64.05 R43.1
INPUT_PIN_5  (via drill 0.33 pad 0, 0.33 pad 0.69)
  Top 0.203: v13.52,100.58 31.12,100.58 31.37,100.33 32.26,100.33 33.21,101.28 44.26,101.28 v45.09,100.46 44.96,100.33
  Bottom 0.203: 9.56,69.81 9.56,83.22 11.94,85.6 11.94,97.66 11.68,97.92 11.68,98.55 12.13,98.93 12.13,99.69 12.89,100.46 13.4,100.46 v13.52,100.58 | IC1.56 46.16,91.38 45.59,91.95 45.59,97.41 46.35,98.17 46.35,99.19 v45.09,100.46
  Bottom 0.254: R46.1 9.56,69.81 9.02,70.36 8.36,70.36 U$24.1
INPUT_PIN_6  (via drill 0.33 pad 0.69)
  Top 0.203: v46.61,99.95 46.48,99.82 44.83,99.82 43.75,100.9 33.45,100.9 32.5,99.95 11.94,99.95 10.92,99 10.92,95.69 v10.35,95.06
  Bottom 0.203: 8.25,69.09 7.24,69.09 6.48,69.85 6.48,75.18 6.98,75.69 7.75,75.69 9.14,77.09 9.14,83.44 10.22,84.52 v10.35,95.06 | IC1.55 46,92.18 45.97,92.2 45.97,97.23 46.74,97.99 46.74,99.82 v46.61,99.95
  Bottom 0.254: U$24.2 6.42,69.78 7.11,69.09 8.25,69.09 8.89,68.45 8.89,67.22 R44.1
LC1_GATE  (via drill 0.33 pad 0.69)
  Top 0.406: v54.48,76.07 55.2,75.31 U$5.4
  Bottom 0.406: U11.18 86.11,83.19 85.98,83.06 84.96,83.06 83.95,82.04 83.95,78.87 82.55,77.41 61.85,77.41 60.2,75.69 54.86,75.69 v54.48,76.07
LC1_ISENSE  (via drill 0.33 pad 0.69)
  Top 0.406: U$20.19 87.76,64.64 85.47,62.36 v85.47,59.31
  Bottom 0.305: 59.44,61.32 U10.5
  Bottom 0.406: U10.5 59.56,61.19 59.56,59.24 61.15,57.78 83.69,57.78 85.34,59.44 v85.47,59.31
LC1_OUTPUT  (via drill 0.38 pad 0.25)
  Top 0.406: v59.82,77.85 59.82,77.72 58.86,76.77
  Top 0.907: U$25.A1 21.64,76.88 22.61,77.85 55.88,77.85 | 55.88,77.85 56.77,77.85 | 56.77,77.85 57.78,77.85 58.86,76.77 59.18,76.45 U$5.1 | U$5.2 57.91,76.71 56.77,77.85 | U$5.3 56.64,77.09 55.88,77.85
  Bottom 0.406: R17.1 58.76,78.91 v59.82,77.85
LC1_VSENSE  (via drill 0.33 pad 0.69, 0.33 pad 0.81)
  Top 0.381: v100.71,70.99 100.71,69.2 100.6,69.09
  Top 0.406: v57.02,82.93 57.02,85.47 59.94,88.39 81.15,88.39 81.66,87.88 85.85,87.88 87.5,86.23 87.5,78.23 v92.84,72.9 | U$20.11 100.6,69.09 100.6,69.2
  Bottom 0.381: v92.84,72.9 98.81,72.9 v100.71,70.99
  Bottom 0.406: R18.1 R17.2 v57.02,82.93
LC2_GATE  (via drill 0.33 pad 0.69)
  Top 0.406: v61.34,75.31 62.82,75.31 U$7.4
  Bottom 0.406: U11.16 85.22,80.64 84.71,80.14 84.71,78.61 82.93,76.83 62.36,76.83 61.34,75.82 v61.34,75.31
LC2_ISENSE  (via drill 0.33 pad 0.69)
  Top 0.406: U$20.20 87.5,63.37 86.23,62.1 v86.23,60.07
  Bottom 0.381: v86.23,60.07 85.98,60.07 85.85,60.2 85.22,60.2
  Bottom 0.406: 85.22,60.2 83.44,58.42 66.93,58.42 65.91,59.44 65.91,61.19 U13.5
LC2_OUTPUT  (via drill 0.33 pad 0.69)
  Top 0.406: v67.06,78.87 67.06,78.49 65.91,77.34
  Top 0.907: U$25.A10 18.87,77.29 20.57,78.99 62.36,78.99 | 62.36,78.99 63.37,78.99 | 63.37,78.99 64.26,78.99 65.91,77.34 66.8,76.45 U$7.1 | U$7.2 65.53,76.83 63.37,78.99 | U$7.3 64.26,77.09 62.36,78.99
  Bottom 0.406: R19.1 67.02,78.91 v67.06,78.87
LC2_VSENSE  (via drill 0.33 pad 0.81)
  Top 0.406: U$20.10 v104.1,63.37 | v91.69,72.26 91.69,73.03 86.61,78.11 86.61,85.85 85.34,87.12 80.58,87.12 79.95,87.76 63.37,87.76 63.05,87.44 63.05,83.5 63.5,83.06 v64.26,83.06
  Bottom 0.381: 103.97,65.93 103.97,63.5 v104.1,63.37
  Bottom 0.406: R19.2 64.14,80.61 | 64.14,80.61 R20.1 | v64.26,83.06 64.26,80.73 64.14,80.61 | 103.97,65.93 99.95,69.98 92.84,69.98 91.69,71.12 v91.69,72.26
LC3_GATE  (via drill 0.33 pad 0.69)
  Top 0.406: v69.22,75.56 69.22,75.31 69.34,75.18 70.57,75.18 U$9.4
  Bottom 0.406: U11.14 85.09,78.11 83.19,76.2 69.85,76.2 v69.22,75.56
LC3_ISENSE  (via drill 0.33 pad 0.69)
  Top 0.406: U$20.21 87.12,62.1 86.87,61.85 86.87,60.96 v87,60.83
  Bottom 0.406: v87,60.83 84.96,60.83 83.19,59.05 73.91,59.05 73.53,59.44 73.53,61.19 U14.5
LC3_OUTPUT  (via drill 0.33 pad 0.69)
  Top 0.406: v74.68,78.61 74.68,77.98 73.91,77.22
  Top 0.907: U$25.A18 15.87,76.19 19.94,80.26 68.33,80.26 | 68.33,80.26 69.6,80.26 | 69.6,80.26 70.87,80.26 73.91,77.22 74.42,76.71 U$9.1 | U$9.2 73.15,76.71 69.6,80.26 | U$9.3 71.88,76.71 68.33,80.26
  Bottom 0.406: R21.1 74.64,78.65 v74.68,78.61
LC3_VSENSE  (via drill 0.33 pad 0.81)
  Top 0.406: U$20.9 v103.31,62.12 | v71.75,82.93 71.75,85.22 72.9,86.36 76.33,86.36 76.77,85.92 79.69,85.92 80.14,86.36 84.96,86.36 85.72,85.6 85.72,77.98 90.68,73.03 v90.68,72.26
  Bottom 0.394: v103.31,62.12 103.33,65.55
  Bottom 0.406: v71.75,82.93 71.75,80.39 | 71.75,80.39 70.78,80.39 R22.1 | R21.2 71.79,80.35 71.75,80.39 | 103.33,65.55 99.57,69.34 92.2,69.34 90.68,70.87 v90.68,72.26
LC4_GATE  (via drill 0.33 pad 0.69)
  Top 0.406: v76.58,75.31 78.06,75.31 U$11.4
  Bottom 0.406: U11.12 76.83,75.56 v76.58,75.31
LC4_ISENSE  (via drill 0.33 pad 0.69)
  Top 0.406: U$20.22 88.27,60.83 v87.76,61.34
  Bottom 0.406: U15.5 81.97,62.1 87.12,62.1 87.76,61.47 v87.76,61.34
LC4_OUTPUT  (via drill 0.33 pad 0.69)
  Top 0.406: v82.3,78.99 82.3,78.61 81.34,77.66
  Top 0.889: U$25.A26 13.96,77.47 15.43,77.47 19.37,81.41
  Top 0.907: 19.37,81.41 74.93,81.41 | 74.93,81.41 76.07,81.41 | 76.07,81.41 77.22,81.41 81.34,77.66 82.04,76.96 U$11.1 | U$11.2 80.77,77.09 76.07,81.41 | U$11.3 79.5,77.34 74.93,81.41
  Bottom 0.406: R23.1 80.64,78.49 80.58,78.42 81.72,78.42 v82.3,78.99
LC4_VSENSE  (via drill 0.33 pad 0.81)
  Top 0.406: U$20.8 102.36,60.83 v102.49,60.96 | v80.64,82.42 80.64,84.96 81.28,85.6 81.41,85.72 84.71,85.72 85.09,85.34 85.09,77.72 89.66,73.15 v89.66,72.26
  Bottom 0.394: v102.49,60.96 102.49,65.41
  Bottom 0.406: R23.2 80.3,80.35 | R24.1 R23.2 | R23.2 v80.64,82.42 | 102.49,65.41 99.19,68.71 91.95,68.71 89.66,70.99 v89.66,72.26
LC5_GATE  (via drill 0.33 pad 0.81)
  Top 0.406: U12.18 83.57,12.32 83.15,11.98 60.32,11.99 v59.56,12.7 | v59.94,17.53 59.94,19.35 U$13.4
  Bottom 0.406: v59.56,12.7 59.56,17.14 v59.94,17.53
LC5_ISENSE  (via drill 0.33 pad 0.69)
  Top 0.406: U$20.23 91.31,59.56 v91.69,59.94
  Bottom 0.406: v91.69,59.94 90.04,59.94 88.14,58.04 88.14,56.01 87.76,55.63 87.63,55.63 85.98,53.98 85.98,48.77 85.85,48.64 83.19,48.64 81.28,46.74 81.28,40.64 80.64,40.01 66.04,40.01 62.99,36.96 56.77,36.96 56.13,36.32 56.13,33.93 U16.5
LC5_OUTPUT  (via drill 0.38 pad 0.25)
  Top 0.381: v58.67,17.65 58.67,17.91 57.91,18.67
  Top 0.907: U$25.B7 21.53,20.38 24.38,17.53 54.48,17.53 | 54.48,17.53 55.75,17.53 | 55.75,17.53 56.77,17.53 57.91,18.67 U$13.3 | U$13.1 55.37,18.41 54.48,17.53 | U$13.2 56.64,18.41 55.75,17.53
  Bottom 0.381: R25.1 57.78,16.76 v58.67,17.65
LC5_VSENSE  (via drill 0.33 pad 0.81)
  Top 0.406: v103.12,50.29 104.01,51.18 104.01,58.42 102.87,59.56 U$20.7
  Bottom 0.406: R26.1 R25.2 57.78,12.32 58.8,11.3 64.14,11.3 64.64,10.79 92.96,10.79 97.85,15.75 97.79,46.8 98.42,47.37 100.2,47.37 v103.12,50.29
LC6_GATE  (via drill 0.33 pad 0.81)
  Top 0.406: U12.16 85.22,14.86 83.19,12.83 v66.8,12.83 | v66.8,16.26 U$15.4
  Bottom 0.406: v66.8,12.83 v66.8,16.26
LC6_ISENSE  (via drill 0.33 pad 0.69)
  Top 0.406: U$20.24 91.19,58.29 v91.31,58.17
  Bottom 0.406: v91.31,58.17 91.31,56.77 89.41,54.86 88.65,54.86 86.61,52.83 86.61,48.26 86.23,47.88 83.69,47.88 82.04,46.23 82.04,39.75 81.41,39.12 66.29,39.12 63.88,36.7 63.88,34.06 U17.5
LC6_OUTPUT  (via drill 0.38 pad 0.25)
  Top 0.381: v65.91,17.14 65.91,17.27 65.15,18.03
  Top 0.907: U$25.B13 18.87,19.11 21.72,16.26 60.83,16.26 | 60.83,16.26 62.1,16.26 | 62.1,16.26 63.37,16.26 65.15,18.03 65.53,18.41 U$15.3 | U$15.1 62.99,18.41 60.83,16.26 | U$15.2 64.26,18.41 62.1,16.26
  Bottom 0.381: R27.1 65.37,16.6 v65.91,17.14
LC6_VSENSE  (via drill 0.33 pad 0.81)
  Top 0.406: v101.98,51.05 103.12,52.2 103.12,57.66 102.49,58.29 U$20.6
  Bottom 0.406: R28.1 R27.2 64.39,11.94 64.77,11.56 92.46,11.56 97.16,15.94 97.22,47.75 97.66,48.26 99.19,48.26 v101.98,51.05
LC7_GATE  (via drill 0.38 pad 0.25)
  Top 0.381: U$17.4 74.42,18.67 v75.56,17.53
  Top 0.406: v83.19,17.53 85.98,17.53 U12.14
  Bottom 0.381: v75.56,17.53 v83.19,17.53
LC7_ISENSE  (via drill 0.33 pad 0.69)
  Top 0.406: U$20.25 89.4,53.96 v88.52,53.09
  Bottom 0.406: v88.52,53.09 88.01,53.09 87.38,52.45 87.38,47.37 87.01,47.03 84.27,47.03 82.8,45.59 82.8,39.24 81.91,38.35 72.52,38.35 71.5,37.34 71.5,34.06 U18.5
LC7_OUTPUT  (via drill 0.38 pad 0.25)
  Top 0.381: v73.91,16.76 73.91,16.89 73.15,17.65
  Top 0.907: U$25.B19 15.87,20.2 20.96,15.11 68.83,15.11 | 68.83,15.11 69.72,15.11 | 69.72,15.11 70.61,15.11 73.15,17.65 U$17.3 | U$17.2 71.88,17.27 69.72,15.11 | U$17.1 70.61,16.89 68.83,15.11
  Bottom 0.381: R29.1 73.75,16.6 v73.91,16.76
LC7_VSENSE  (via drill 0.33 pad 0.81)
  Top 0.406: v100.58,51.44 100.58,57.01 U$20.5
  Bottom 0.406: R30.1 R29.2 71.75,14.1 72.77,13.08 92.2,13.08 95.5,16.38 95.5,47.75 97.03,49.28 98.42,49.28 v100.58,51.44
LC8_GATE
  Top 0.406: U$19.4 84.03,20.11 84.2,19.94 U12.12
LC8_ISENSE  (via drill 0.33 pad 0.81)
  Top 0.406: U$20.26 v91.19,52.07
  Bottom 0.406: v91.19,52.07 91.19,49.66 92.58,48.26 92.58,40.26 89.14,36.87 79.65,36.87 79.12,36.32 79.12,34.06 U19.5
LC8_OUTPUT  (via drill 0.38 pad 0.25)
  Top 0.406: v82.17,16.64 82.17,17.53 82.04,17.65 80.77,17.65
  Top 0.907: U$25.B26 13.4,20.38 19.81,13.97 75.18,13.97 | 75.18,13.97 76.07,13.97 | 76.07,13.97 77.09,13.97 80.77,17.65 U$19.3 | U$19.2 79.5,17.4 76.07,13.97 | U$19.1 78.23,17.02 75.18,13.97
  Bottom 0.406: R31.1 81.88,16.6 v82.17,16.64
LC8_VSENSE  (via drill 0.33 pad 0.81)
  Top 0.406: v98.81,51.56 U$20.4
  Bottom 0.406: R32.1 R31.2 83.35,14.9 84.45,16 93.34,16 93.85,16.51 93.85,48.13 97.28,51.56 v98.81,51.56
M8RXD  (via drill 0.33 pad 0.69)
  Top 0.229: 40.39,84.14 46.04,84.14 v47.24,82.93
  Top 0.254: v29.66,88.9 29.67,87.66 30.61,86.73 30.61,85.72 29.97,85.09 29.97,82.93 30.23,82.68 40,82.68 40.39,83.06 40.39,84.14
  Bottom 0.254: IC5.1 29.49,88.93 v29.66,88.9 | v47.24,82.93 47.24,79.38 46.48,78.61 45.15,78.61 R2.1
M8TXD  (via drill 0.33 pad 0.69)
  Top 0.203: 46.48,84.58 v48.13,82.93
  Top 0.229: 46.48,84.58 40.13,84.58
  Top 0.254: 40.13,84.58 39.88,84.33 39.88,83.31 39.75,83.19 36.96,83.25 35.43,84.77 32,84.77 31.69,85.09 31.12,85.09 31.12,87.08 30.33,87.86 30.32,89.26 30.04,89.53 29.08,89.53 28.39,88.84 28.39,87.95 v29.97,86.36
  Bottom 0.203: v48.13,82.93 48.15,79.35 47.89,79.11
  Bottom 0.254: R7.1 42.93,77.98 43.56,77.34 46.15,77.33 47.89,79.11 | v29.97,86.36 28.29,86.36 IC5.5
N$1
  pour Top (rank 2, no thermals): 26.8,33.02 38.23,33.02 38.23,27.43 26.8,27.43
  pour Bottom (no thermals): 26.8,33.02 38.23,33.02 38.23,27.43 26.8,27.43
  pour Top (no thermals): 29.08,36.32 29.08,35.81 26.8,33.02 38.23,33.02 34.42,35.56 34.42,36.32
N$2  (via drill 0.33 pad 0.69)
  Top 0.203: v36.45,42.55 36.45,43.88 RS1.SENSE1
  Bottom 0.203: U1.8 35.38,42.72 35.81,42.29 36.2,42.29 v36.45,42.55
N$3  (via drill 0.33 pad 0.69)
  Top 0.203: v36.32,38.86 36.32,37.27 RS1.SENSE2
  Bottom 0.203: U1.1 35.38,38.56 35.81,38.99 36.2,38.99 v36.32,38.86
N$4
  Bottom 0.203: C5.1 33.19,40.6 34.04,39.75 34.04,38.43 U1.3
N$5
  Top 0.406: U2.3 100.41,32.59 101.35,33.53 103.63,33.53 103.76,33.66 103.76,35.85 | R4.2 103.76,35.85 | 103.76,35.85 R5.1
N$6  (via drill 0.33 pad 0.69)
  Top 0.254: v15.75,82.55 16.76,82.55 17.4,83.19 19.53,83.19 IC2.8
  Bottom 0.254: R3.1 v15.75,82.55
N$7  (via drill 0.33)
  Top 0.254: R12.1 102.59,38.9 99.82,36.13 99.82,36.01 v99.38,35.56 | v98.61,29.27 99.73,29.27 U4.3
  Top 0.406: R12.1 R11.2
  Bottom 0.254: v99.38,35.56 99.25,35.56 98.61,34.92 v98.61,29.27
N$8
  pour Bottom (no thermals): 42.04,67.82 53.47,67.82 53.47,62.23 42.04,62.23
  pour Top (rank 4, no thermals): 42.04,67.82 53.47,67.82 53.47,62.23 42.04,62.23
  pour Top (no thermals): 43.05,59.18 43.05,59.44 42.04,62.23 53.47,62.23 48.64,59.69 48.64,59.18
N$9
  Top 0.381: VCC!.A 103.76,88.45 R6.1
N$10  (via drill 0.33 pad 0.69)
  Top 0.203: v48.77,53.85 49.28,53.85 49.91,53.21 49.91,50.99 RS2.SENSE2
  Bottom 0.203: U7.8 46.15,54.28 46.35,54.48 48.13,54.48 v48.77,53.85
N$11  (via drill 0.33 pad 0.69)
  Top 0.305: Q1.1 23.37,96.39 19.81,92.84 19.81,91.69 | 19.81,91.69 19.81,91.19 v20.19,90.81 | C1.2 20.19,92.08 19.81,91.69
  Bottom 0.305: v20.19,90.81 20.45,90.55 31.52,90.55 IC1.24
N$12  (via drill 0.33 pad 0.69)
  Top 0.203: v50.93,58.55 50.23,58.55 RS2.SENSE1
  Bottom 0.203: U7.1 46.15,58.47 46.48,58.8 50.67,58.8 v50.93,58.55
N$14
  Top 0.254: 107.44,25.78 109.73,25.78 110.3,25.21 110.3,19.94 109.03,18.67 107.57,18.67 107.44,18.54
  Top 0.381: R14.1 107.02,18.12 107.44,18.54 | U5.3 99.8,26.16 100.97,26.16 100.97,26.42 101.35,26.8 106.43,26.8 107.44,25.78
  Top 0.406: R13.2 R14.1
N$15
  Top 0.406: R15.2 R16.1 101.75,21.17 99.94,22.99 99.82,22.99 U6.3
N$16
  Bottom 0.203: C6.1 47.92,54.95 47.5,55.37 47.5,56.82 U7.3
N$17
  pour Top (rank 3, no thermals): 25.53,67.82 36.96,67.82 36.96,62.23 25.53,62.23
  pour Bottom: 25.53,67.82 36.96,67.82 36.96,62.23 25.53,62.23
  pour Top (rank 3, no thermals): 29.08,58.67 29.08,59.44 25.53,62.23 36.96,62.23 34.67,59.44 34.67,58.67
N$18  (via drill 0.33 pad 0.69)
  Top 0.203: v34.8,53.59 35.81,53.59 35.94,53.47 35.94,50.99 RS3.SENSE2
  Bottom 0.203: U8.8 32.82,53.39 33.02,53.59 v34.8,53.59
N$19  (via drill 0.33 pad 0.69)